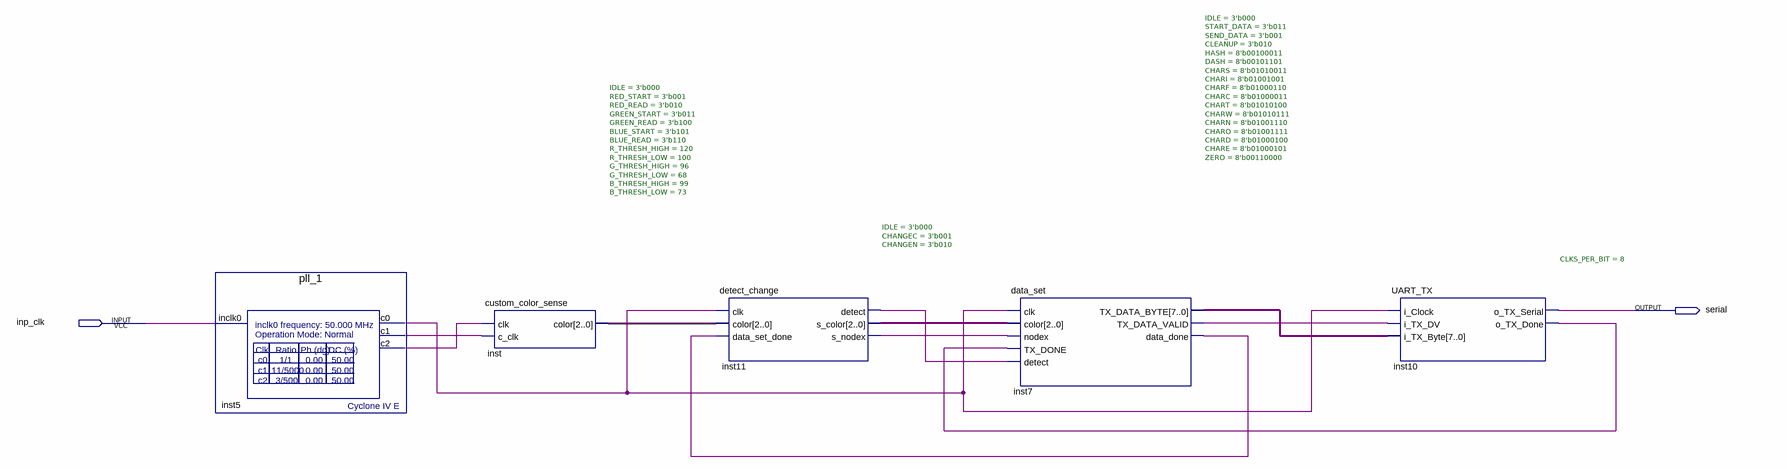
[diagram p0: schematic sheet]
// Quartus schematic pri_test.bdf as structural Verilog: 5 symbols, 2 pins
module pri_test (
  input  inp_clk,
  output serial
);

  wire inst5_c0, inst5_c1, inst5_c2, inst7_data_done, inst7_tx_data_valid, inst10_o_tx_done, inst11_detect,
       inst11_s_nodex;
  wire [2:0] inst11_s_color, inst_color;
  wire [7:0] inst7_tx_data_byte;

  pll_1 inst5 (.inclk0(inp_clk), .c0(inst5_c0), .c1(inst5_c1), .c2(inst5_c2));
  custom_color_sense #(.IDLE(3'b000), .RED_START(3'b001), .RED_READ(3'b010), .GREEN_START(3'b011), .GREEN_READ(3'b100), .BLUE_START(3'b101), .BLUE_READ(3'b110), .R_THRESH_HIGH(120), .R_THRESH_LOW(100), .G_THRESH_HIGH(96), .G_THRESH_LOW(68), .B_THRESH_HIGH(99), .B_THRESH_LOW(73)) inst (
    .clk(inst5_c2), .c_clk(inst5_c1), .color(inst_color));
  detect_change #(.IDLE(3'b000), .CHANGEC(3'b001), .CHANGEN(3'b010)) inst11 (
    .clk(inst5_c0), .color(inst_color), .data_set_done(inst7_data_done), .detect(inst11_detect),
    .s_color(inst11_s_color), .s_nodex(inst11_s_nodex));
  data_set #(.IDLE(3'b000), .START_DATA(3'b011), .SEND_DATA(3'b001), .CLEANUP(3'b010), .HASH(8'b00100011), .DASH(8'b00101101), .CHARS(8'b01010011), .CHARI(8'b01001001), .CHARF(8'b01000110), .CHARC(8'b01000011), .CHART(8'b01010100), .CHARW(8'b01010111), .CHARN(8'b01001110), .CHARO(8'b01001111), .CHARD(8'b01000100), .CHARE(8'b01000101), .ZERO(8'b00110000)) inst7 (
    .clk(inst5_c0), .color(inst11_s_color), .nodex(inst11_s_nodex), .TX_DONE(inst10_o_tx_done),
    .detect(inst11_detect), .TX_DATA_BYTE(inst7_tx_data_byte), .TX_DATA_VALID(inst7_tx_data_valid),
    .data_done(inst7_data_done));
  UART_TX #(.CLKS_PER_BIT(8)) inst10 (
    .i_Clock(inst5_c0), .i_TX_DV(inst7_tx_data_valid), .i_TX_Byte(inst7_tx_data_byte), .o_TX_Serial(serial),
    .o_TX_Done(inst10_o_tx_done));
endmodule
